# Altium schematic sheet Crystal 16MHz 3225.SchDoc
size A4
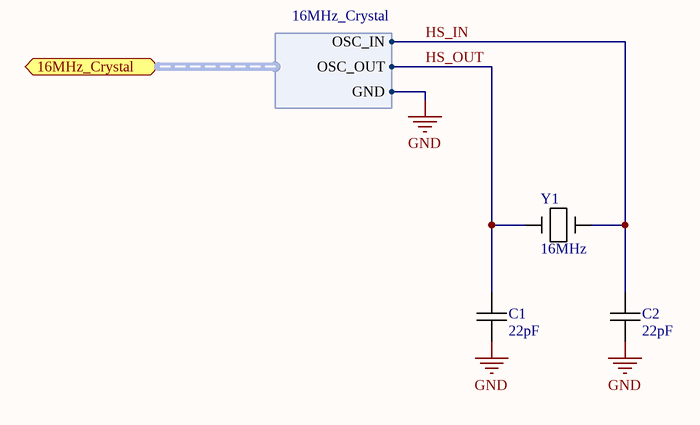
[diagram p0: Crystal 16MHz 3225.SchDoc]

## Parts
C1  22pF  [0603C-GENERIC]
C2  22pF  [0603C-GENERIC]
Y1  16MHz  [3225]

## Ports
16MHz_Crystal (harness 16MHz_Crystal)

## Harnesses
16MHz_Crystal: OSC_IN, OSC_OUT, GND

## Nets
GND: C1.2 C2.2 Y1.2 Y1.4 ; port 16MHz_Crystal.GND
HS_IN: C2.1 Y1.3 ; port 16MHz_Crystal.OSC_IN
HS_OUT: C1.1 Y1.1 ; port 16MHz_Crystal.OSC_OUT

## Library data of the parts
C1 C2 = 0603C-22PF-50V-C0G-PAN: CAPACITOR 0603 CERAMIC; Manufacturer Part Number: ECJ-1VC1H220J; Manufacturer: Panasonic - ECG; Reel: C10; Tolerance: ±5%; Temperature Coefficient: C0G, NP0; Voltage - Rated: 50V; Supplier 1: Digi-Key; Features: General Purpose; Lead Spacing: -; Supplier: Digi-Key; Capacitance: 22pF; Packaging: Tape & Reel (TR); Mounting Type: Surface Mount, MLCC; RoHS: RoHS Compliant; Operating Temperature: -55°C ~ 125°C; Thickness: 0.80mm; Package / Case: 0603 (1608 metric); Category: Capacitors; Supplier Part Number 1: PCC220ACVTR-ND; Supplier Part Number: PCC220ACVTR-ND
Y1 = 3225 CRYSTAL